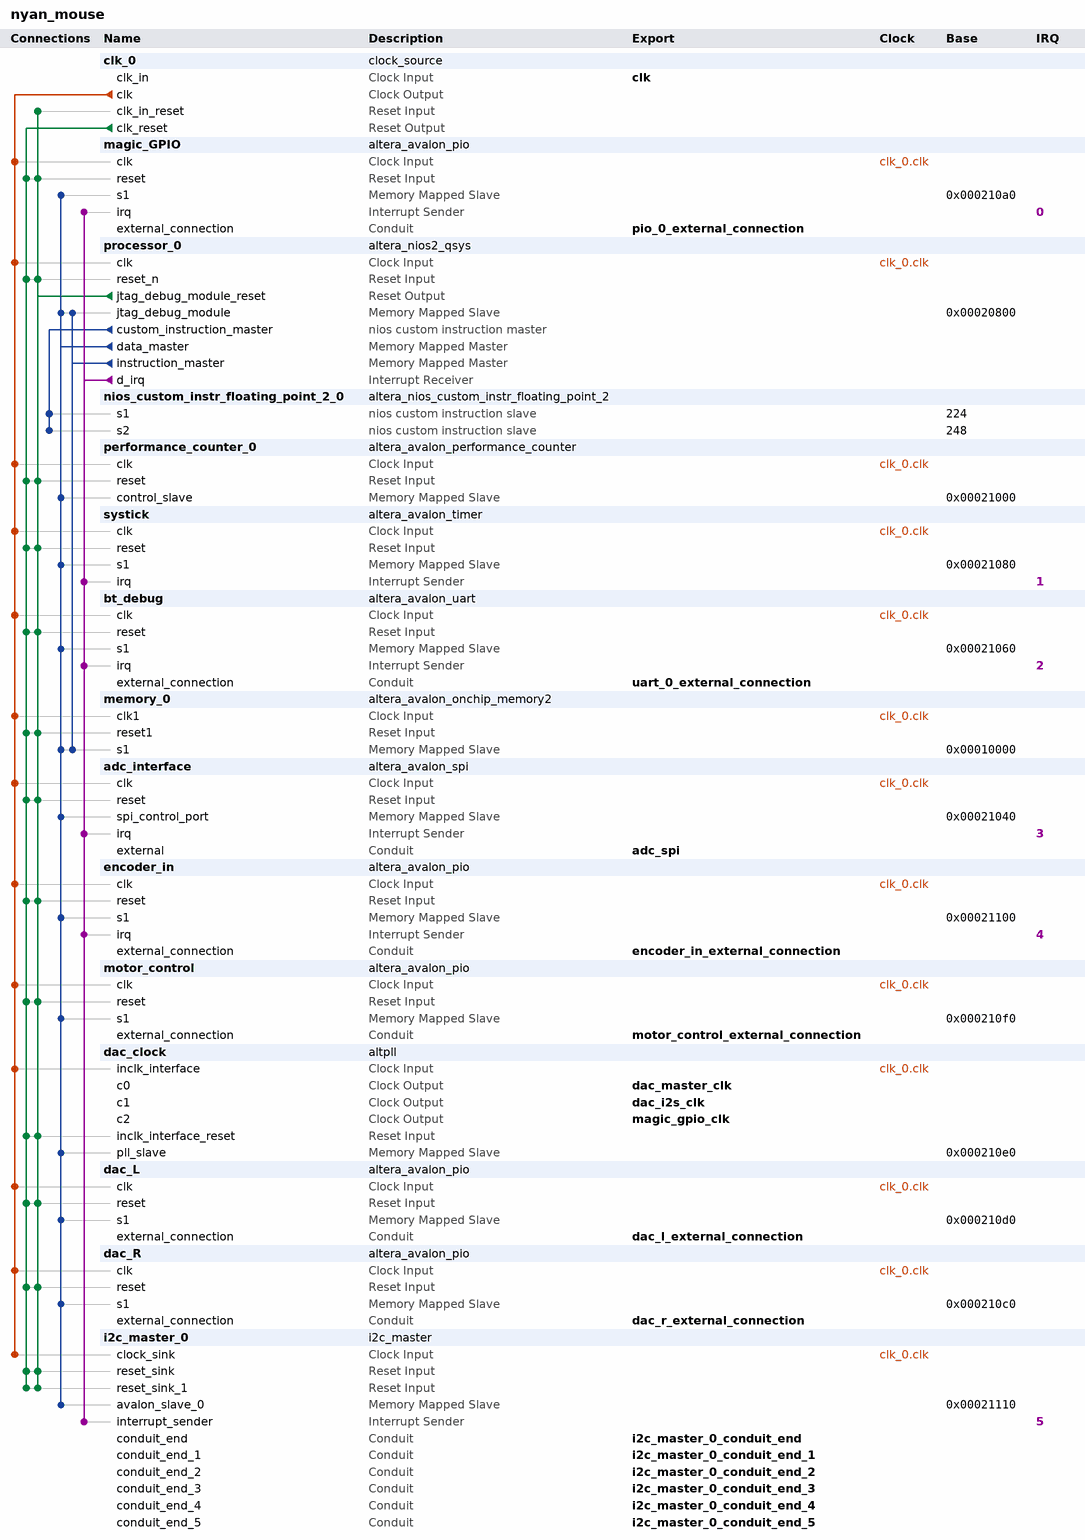
[diagram p0: system contents]
# Platform Designer (Qsys) system nyan_mouse, Cyclone IV E EP4CE15E22C8
# Parameters at their usual value, and those the tool derives, are not listed.
package require -exact qsys 13.1
create_system nyan_mouse
set_project_property DEVICE_FAMILY {Cyclone IV E}
set_project_property DEVICE EP4CE15E22C8

add_instance clk_0 clock_source 13.1
set_instance_parameter_value clk_0 clockFrequency 50000000

add_instance magic_GPIO altera_avalon_pio 13.1
set_instance_parameter_value magic_GPIO bitClearingEdgeCapReg true
set_instance_parameter_value magic_GPIO bitModifyingOutReg true
set_instance_parameter_value magic_GPIO captureEdge true
set_instance_parameter_value magic_GPIO direction InOut
set_instance_parameter_value magic_GPIO edgeType ANY
set_instance_parameter_value magic_GPIO generateIRQ true
set_instance_parameter_value magic_GPIO irqType EDGE
set_instance_parameter_value magic_GPIO width 32

add_instance processor_0 altera_nios2_qsys 13.1
set_instance_parameter_value processor_0 muldiv_divider true
set_instance_parameter_value processor_0 resetSlave processor_0.jtag_debug_module
set_instance_parameter_value processor_0 mmu_TLBMissExcSlave None
set_instance_parameter_value processor_0 exceptionSlave processor_0.jtag_debug_module
set_instance_parameter_value processor_0 breakSlave processor_0.jtag_debug_module
set_instance_parameter_value processor_0 impl Fast
set_instance_parameter_value processor_0 icache_size 8192
set_instance_parameter_value processor_0 debug_level Level2

add_instance nios_custom_instr_floating_point_2_0 altera_nios_custom_instr_floating_point_2 100.99.98.97

add_instance performance_counter_0 altera_avalon_performance_counter 13.1
set_instance_parameter_value performance_counter_0 numberOfSections 3

add_instance systick altera_avalon_timer 13.1
set_instance_parameter_value systick alwaysRun true
set_instance_parameter_value systick fixedPeriod true
set_instance_parameter_value systick period 10
set_instance_parameter_value systick periodUnits USEC
set_instance_parameter_value systick snapshot false

add_instance bt_debug altera_avalon_uart 13.1
set_instance_parameter_value bt_debug baud 115200
set_instance_parameter_value bt_debug dataBits 8
set_instance_parameter_value bt_debug fixedBaud true
set_instance_parameter_value bt_debug parity NONE
set_instance_parameter_value bt_debug stopBits 1

add_instance memory_0 altera_avalon_onchip_memory2 13.1
set_instance_parameter_value memory_0 dataWidth 32
set_instance_parameter_value memory_0 dualPort false
set_instance_parameter_value memory_0 initMemContent true
set_instance_parameter_value memory_0 initializationFileName onchip_mem.hex
set_instance_parameter_value memory_0 memorySize 65536

add_instance adc_interface altera_avalon_spi 13.1
set_instance_parameter_value adc_interface clockPolarity 0
set_instance_parameter_value adc_interface dataWidth 16
set_instance_parameter_value adc_interface masterSPI true
set_instance_parameter_value adc_interface numberOfSlaves 1
set_instance_parameter_value adc_interface targetClockRate 8000000

add_instance encoder_in altera_avalon_pio 13.1
set_instance_parameter_value encoder_in captureEdge true
set_instance_parameter_value encoder_in direction Input
set_instance_parameter_value encoder_in edgeType ANY
set_instance_parameter_value encoder_in generateIRQ true
set_instance_parameter_value encoder_in irqType EDGE
set_instance_parameter_value encoder_in width 4

add_instance motor_control altera_avalon_pio 13.1
set_instance_parameter_value motor_control direction Output
set_instance_parameter_value motor_control width 4

add_instance dac_clock altpll 13.1
set_instance_parameter_value dac_clock INCLK0_INPUT_FREQUENCY 20000
set_instance_parameter_value dac_clock CLK0_MULTIPLY_BY 8467
set_instance_parameter_value dac_clock CLK1_MULTIPLY_BY 441
set_instance_parameter_value dac_clock CLK2_MULTIPLY_BY 2
set_instance_parameter_value dac_clock CLK0_DIVIDE_BY 50000
set_instance_parameter_value dac_clock CLK1_DIVIDE_BY 15625
set_instance_parameter_value dac_clock CLK2_DIVIDE_BY 1
set_instance_parameter_value dac_clock CLK1_PHASE_SHIFT 0
set_instance_parameter_value dac_clock CLK2_PHASE_SHIFT 0
set_instance_parameter_value dac_clock CLK1_DUTY_CYCLE 50
set_instance_parameter_value dac_clock CLK2_DUTY_CYCLE 50
set_instance_parameter_value dac_clock PORT_clk1 PORT_USED
set_instance_parameter_value dac_clock PORT_clk2 PORT_USED
set_instance_parameter_value dac_clock PORT_clk3 PORT_UNUSED
set_instance_parameter_value dac_clock PORT_ARESET PORT_UNUSED
set_instance_parameter_value dac_clock PORT_LOCKED PORT_UNUSED

add_instance dac_L altera_avalon_pio 13.1
set_instance_parameter_value dac_L direction Output
set_instance_parameter_value dac_L width 16

add_instance dac_R altera_avalon_pio 13.1
set_instance_parameter_value dac_R direction Output
set_instance_parameter_value dac_R width 16

add_instance i2c_master_0 i2c_master 1.0
set_instance_parameter_value i2c_master_0 ARST_LVL 0

# connections
add_connection clk_0.clk adc_interface.clk clock
add_connection clk_0.clk bt_debug.clk clock
add_connection clk_0.clk dac_clock.inclk_interface clock
add_connection clk_0.clk dac_L.clk clock
add_connection clk_0.clk dac_R.clk clock
add_connection clk_0.clk encoder_in.clk clock
add_connection clk_0.clk i2c_master_0.clock_sink clock
add_connection clk_0.clk magic_GPIO.clk clock
add_connection clk_0.clk memory_0.clk1 clock
add_connection clk_0.clk motor_control.clk clock
add_connection clk_0.clk performance_counter_0.clk clock
add_connection clk_0.clk processor_0.clk clock
add_connection clk_0.clk systick.clk clock
add_connection clk_0.clk_reset adc_interface.reset reset
add_connection clk_0.clk_reset bt_debug.reset reset
add_connection clk_0.clk_reset dac_clock.inclk_interface_reset reset
add_connection clk_0.clk_reset dac_L.reset reset
add_connection clk_0.clk_reset dac_R.reset reset
add_connection clk_0.clk_reset encoder_in.reset reset
add_connection clk_0.clk_reset i2c_master_0.reset_sink reset
add_connection clk_0.clk_reset i2c_master_0.reset_sink_1 reset
add_connection clk_0.clk_reset magic_GPIO.reset reset
add_connection clk_0.clk_reset memory_0.reset1 reset
add_connection clk_0.clk_reset motor_control.reset reset
add_connection clk_0.clk_reset performance_counter_0.reset reset
add_connection clk_0.clk_reset processor_0.reset_n reset
add_connection clk_0.clk_reset systick.reset reset
add_connection processor_0.jtag_debug_module_reset adc_interface.reset reset
add_connection processor_0.jtag_debug_module_reset bt_debug.reset reset
add_connection processor_0.jtag_debug_module_reset clk_0.clk_in_reset reset
add_connection processor_0.jtag_debug_module_reset dac_clock.inclk_interface_reset reset
add_connection processor_0.jtag_debug_module_reset dac_L.reset reset
add_connection processor_0.jtag_debug_module_reset dac_R.reset reset
add_connection processor_0.jtag_debug_module_reset encoder_in.reset reset
add_connection processor_0.jtag_debug_module_reset i2c_master_0.reset_sink reset
add_connection processor_0.jtag_debug_module_reset i2c_master_0.reset_sink_1 reset
add_connection processor_0.jtag_debug_module_reset magic_GPIO.reset reset
add_connection processor_0.jtag_debug_module_reset memory_0.reset1 reset
add_connection processor_0.jtag_debug_module_reset motor_control.reset reset
add_connection processor_0.jtag_debug_module_reset performance_counter_0.reset reset
add_connection processor_0.jtag_debug_module_reset processor_0.reset_n reset
add_connection processor_0.jtag_debug_module_reset systick.reset reset
add_connection processor_0.data_master adc_interface.spi_control_port avalon
set_connection_parameter_value processor_0.data_master/adc_interface.spi_control_port baseAddress 0x00021040
add_connection processor_0.data_master bt_debug.s1 avalon
set_connection_parameter_value processor_0.data_master/bt_debug.s1 baseAddress 0x00021060
add_connection processor_0.data_master dac_clock.pll_slave avalon
set_connection_parameter_value processor_0.data_master/dac_clock.pll_slave baseAddress 0x000210e0
add_connection processor_0.data_master dac_L.s1 avalon
set_connection_parameter_value processor_0.data_master/dac_L.s1 baseAddress 0x000210d0
add_connection processor_0.data_master dac_R.s1 avalon
set_connection_parameter_value processor_0.data_master/dac_R.s1 baseAddress 0x000210c0
add_connection processor_0.data_master encoder_in.s1 avalon
set_connection_parameter_value processor_0.data_master/encoder_in.s1 baseAddress 0x00021100
add_connection processor_0.data_master i2c_master_0.avalon_slave_0 avalon
set_connection_parameter_value processor_0.data_master/i2c_master_0.avalon_slave_0 baseAddress 0x00021110
add_connection processor_0.data_master magic_GPIO.s1 avalon
set_connection_parameter_value processor_0.data_master/magic_GPIO.s1 baseAddress 0x000210a0
add_connection processor_0.data_master memory_0.s1 avalon
set_connection_parameter_value processor_0.data_master/memory_0.s1 baseAddress 0x00010000
add_connection processor_0.data_master motor_control.s1 avalon
set_connection_parameter_value processor_0.data_master/motor_control.s1 baseAddress 0x000210f0
add_connection processor_0.data_master performance_counter_0.control_slave avalon
set_connection_parameter_value processor_0.data_master/performance_counter_0.control_slave baseAddress 0x00021000
add_connection processor_0.data_master processor_0.jtag_debug_module avalon
set_connection_parameter_value processor_0.data_master/processor_0.jtag_debug_module baseAddress 0x00020800
add_connection processor_0.data_master systick.s1 avalon
set_connection_parameter_value processor_0.data_master/systick.s1 baseAddress 0x00021080
add_connection processor_0.instruction_master memory_0.s1 avalon
set_connection_parameter_value processor_0.instruction_master/memory_0.s1 baseAddress 0x00010000
add_connection processor_0.instruction_master processor_0.jtag_debug_module avalon
set_connection_parameter_value processor_0.instruction_master/processor_0.jtag_debug_module baseAddress 0x00020800
add_connection processor_0.d_irq adc_interface.irq interrupt
set_connection_parameter_value processor_0.d_irq/adc_interface.irq irqNumber 3
add_connection processor_0.d_irq bt_debug.irq interrupt
set_connection_parameter_value processor_0.d_irq/bt_debug.irq irqNumber 2
add_connection processor_0.d_irq encoder_in.irq interrupt
set_connection_parameter_value processor_0.d_irq/encoder_in.irq irqNumber 4
add_connection processor_0.d_irq i2c_master_0.interrupt_sender interrupt
set_connection_parameter_value processor_0.d_irq/i2c_master_0.interrupt_sender irqNumber 5
add_connection processor_0.d_irq magic_GPIO.irq interrupt
set_connection_parameter_value processor_0.d_irq/magic_GPIO.irq irqNumber 0
add_connection processor_0.d_irq systick.irq interrupt
set_connection_parameter_value processor_0.d_irq/systick.irq irqNumber 1
add_connection processor_0.custom_instruction_master nios_custom_instr_floating_point_2_0.s1 nios_custom_instruction
set_connection_parameter_value processor_0.custom_instruction_master/nios_custom_instr_floating_point_2_0.s1 CIName nios_custom_instr_floating_point_2_0
set_connection_parameter_value processor_0.custom_instruction_master/nios_custom_instr_floating_point_2_0.s1 baseAddress 224
add_connection processor_0.custom_instruction_master nios_custom_instr_floating_point_2_0.s2 nios_custom_instruction
set_connection_parameter_value processor_0.custom_instruction_master/nios_custom_instr_floating_point_2_0.s2 CIName nios_custom_instr_floating_point_2_0_1
set_connection_parameter_value processor_0.custom_instruction_master/nios_custom_instr_floating_point_2_0.s2 baseAddress 248

# exported interfaces
add_interface clk clock sink
set_interface_property clk EXPORT_OF clk_0.clk_in
add_interface pio_0_external_connection conduit end
set_interface_property pio_0_external_connection EXPORT_OF magic_GPIO.external_connection
add_interface uart_0_external_connection conduit end
set_interface_property uart_0_external_connection EXPORT_OF bt_debug.external_connection
add_interface adc_spi conduit end
set_interface_property adc_spi EXPORT_OF adc_interface.external
add_interface encoder_in_external_connection conduit end
set_interface_property encoder_in_external_connection EXPORT_OF encoder_in.external_connection
add_interface motor_control_external_connection conduit end
set_interface_property motor_control_external_connection EXPORT_OF motor_control.external_connection
add_interface dac_master_clk clock source
set_interface_property dac_master_clk EXPORT_OF dac_clock.c0
add_interface dac_i2s_clk clock source
set_interface_property dac_i2s_clk EXPORT_OF dac_clock.c1
add_interface magic_gpio_clk clock source
set_interface_property magic_gpio_clk EXPORT_OF dac_clock.c2
add_interface dac_l_external_connection conduit end
set_interface_property dac_l_external_connection EXPORT_OF dac_L.external_connection
add_interface dac_r_external_connection conduit end
set_interface_property dac_r_external_connection EXPORT_OF dac_R.external_connection
add_interface i2c_master_0_conduit_end conduit end
set_interface_property i2c_master_0_conduit_end EXPORT_OF i2c_master_0.conduit_end
add_interface i2c_master_0_conduit_end_1 conduit end
set_interface_property i2c_master_0_conduit_end_1 EXPORT_OF i2c_master_0.conduit_end_1
add_interface i2c_master_0_conduit_end_2 conduit end
set_interface_property i2c_master_0_conduit_end_2 EXPORT_OF i2c_master_0.conduit_end_2
add_interface i2c_master_0_conduit_end_3 conduit end
set_interface_property i2c_master_0_conduit_end_3 EXPORT_OF i2c_master_0.conduit_end_3
add_interface i2c_master_0_conduit_end_4 conduit end
set_interface_property i2c_master_0_conduit_end_4 EXPORT_OF i2c_master_0.conduit_end_4
add_interface i2c_master_0_conduit_end_5 conduit end
set_interface_property i2c_master_0_conduit_end_5 EXPORT_OF i2c_master_0.conduit_end_5

set_interconnect_requirement {$system} qsys_mm.clockCrossingAdapter HANDSHAKE
set_interconnect_requirement {$system} qsys_mm.maxAdditionalLatency 1
set_interconnect_requirement {$system} qsys_mm.insertDefaultSlave false

save_system nyan_mouse.qsys
